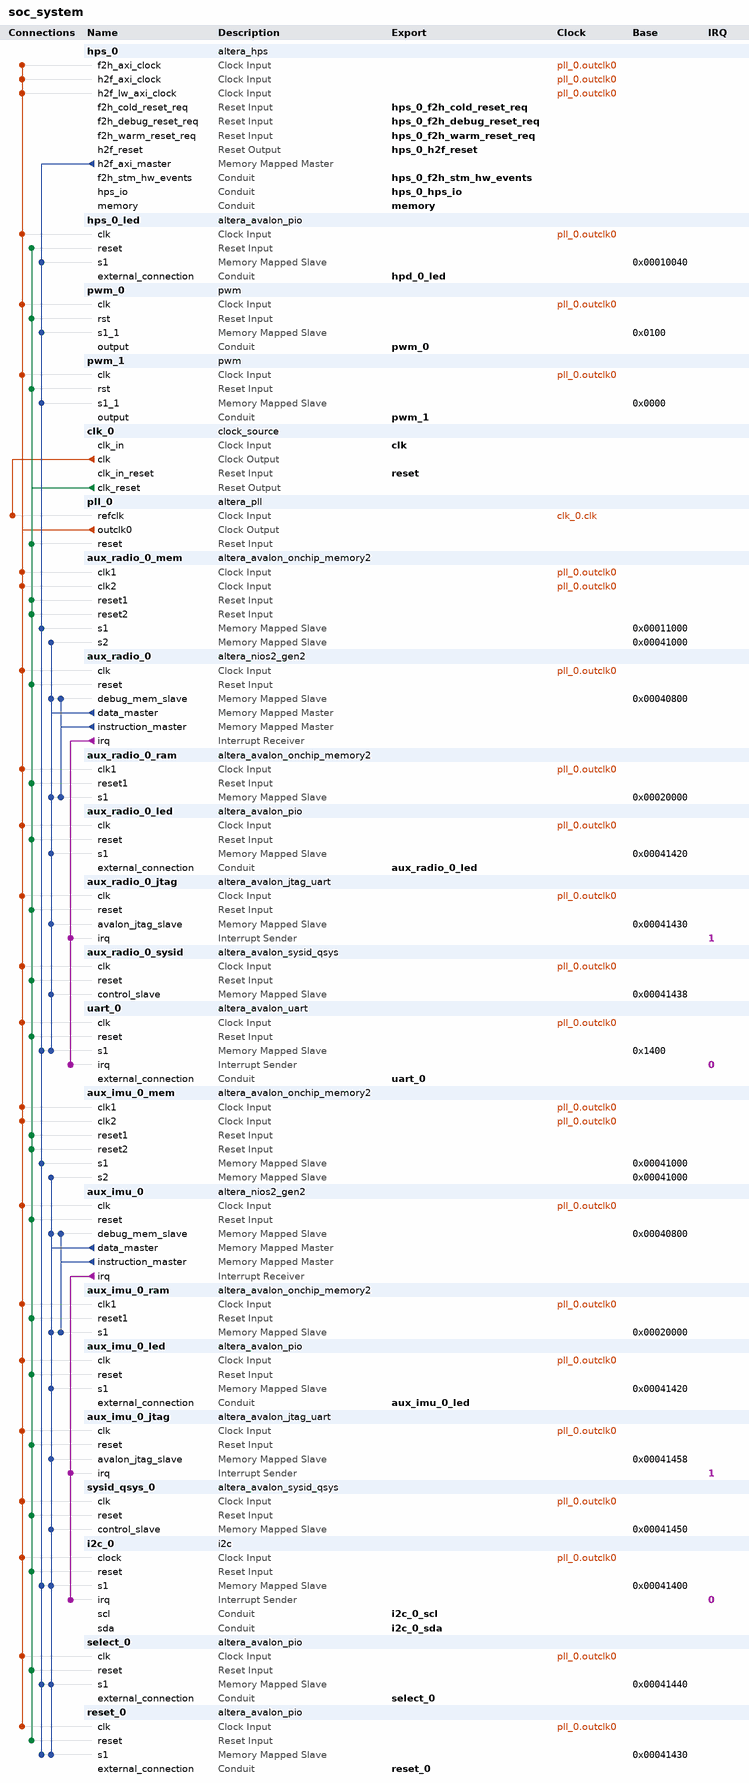
[diagram p0: system contents]
# Platform Designer (Qsys) system soc_system, Cyclone V 5CSEMA4U23C6
# Parameters at their usual value, and those the tool derives, are not listed.
package require -exact qsys 16.0
create_system soc_system
set_project_property DEVICE_FAMILY {Cyclone V}
set_project_property DEVICE 5CSEMA4U23C6

add_instance hps_0 altera_hps 16.0
set_instance_parameter_value hps_0 EMAC1_Mode RGMII
set_instance_parameter_value hps_0 EMAC1_PinMuxing {HPS I/O Set 0}
set_instance_parameter_value hps_0 F2SCLK_COLDRST_Enable true
set_instance_parameter_value hps_0 F2SCLK_DBGRST_Enable true
set_instance_parameter_value hps_0 F2SCLK_WARMRST_Enable true
set_instance_parameter_value hps_0 F2SINTERRUPT_Enable true
set_instance_parameter_value hps_0 F2S_Width 3
set_instance_parameter_value hps_0 FPGA_PERIPHERAL_OUTPUT_CLOCK_FREQ_EMAC0_GTX_CLK 100
set_instance_parameter_value hps_0 FPGA_PERIPHERAL_OUTPUT_CLOCK_FREQ_EMAC0_MD_CLK 100.0
set_instance_parameter_value hps_0 FPGA_PERIPHERAL_OUTPUT_CLOCK_FREQ_EMAC1_GTX_CLK 100
set_instance_parameter_value hps_0 FPGA_PERIPHERAL_OUTPUT_CLOCK_FREQ_EMAC1_MD_CLK 100.0
set_instance_parameter_value hps_0 HPS_PROTOCOL DDR3
set_instance_parameter_value hps_0 I2C0_Mode I2C
set_instance_parameter_value hps_0 I2C0_PinMuxing {HPS I/O Set 0}
set_instance_parameter_value hps_0 I2C1_Mode I2C
set_instance_parameter_value hps_0 I2C1_PinMuxing {HPS I/O Set 0}
set_instance_parameter_value hps_0 LWH2F_Enable true
set_instance_parameter_value hps_0 MEM_BANKADDR_WIDTH 3
set_instance_parameter_value hps_0 MEM_CLK_FREQ 400.0
set_instance_parameter_value hps_0 MEM_COL_ADDR_WIDTH 10
set_instance_parameter_value hps_0 MEM_DQ_WIDTH 32
set_instance_parameter_value hps_0 MEM_DRV_STR RZQ/6
set_instance_parameter_value hps_0 MEM_ROW_ADDR_WIDTH 15
set_instance_parameter_value hps_0 MEM_RTT_NOM RZQ/6
set_instance_parameter_value hps_0 MEM_RTT_WR {Dynamic ODT off}
set_instance_parameter_value hps_0 MEM_TCL 7
set_instance_parameter_value hps_0 MEM_TFAW_NS 37.5
set_instance_parameter_value hps_0 MEM_TRAS_NS 35.0
set_instance_parameter_value hps_0 MEM_TRCD_NS 13.75
set_instance_parameter_value hps_0 MEM_TRFC_NS 300.0
set_instance_parameter_value hps_0 MEM_TRP_NS 13.75
set_instance_parameter_value hps_0 MEM_VENDOR Other
set_instance_parameter_value hps_0 MEM_WTCL 7
set_instance_parameter_value hps_0 QSPI_Mode N/A
set_instance_parameter_value hps_0 QSPI_PinMuxing Unused
set_instance_parameter_value hps_0 REF_CLK_FREQ 25.0
set_instance_parameter_value hps_0 S2FCLK_USER2CLK 5
set_instance_parameter_value hps_0 S2F_Width 2
set_instance_parameter_value hps_0 SDIO_Mode {4-bit Data}
set_instance_parameter_value hps_0 SDIO_PinMuxing {HPS I/O Set 0}
set_instance_parameter_value hps_0 SPIM1_Mode {Single Slave Select}
set_instance_parameter_value hps_0 SPIM1_PinMuxing {HPS I/O Set 0}
set_instance_parameter_value hps_0 STM_Enable true
set_instance_parameter_value hps_0 TIMING_BOARD_AC_SKEW 0.02
set_instance_parameter_value hps_0 TIMING_BOARD_AC_TO_CK_SKEW 0.0
set_instance_parameter_value hps_0 TIMING_BOARD_DQ_TO_DQS_SKEW 0.0
set_instance_parameter_value hps_0 TIMING_BOARD_MAX_CK_DELAY 0.6
set_instance_parameter_value hps_0 TIMING_BOARD_MAX_DQS_DELAY 0.6
set_instance_parameter_value hps_0 TIMING_BOARD_SKEW_BETWEEN_DQS 0.02
set_instance_parameter_value hps_0 TIMING_BOARD_SKEW_CKDQS_DIMM_MAX 0.01
set_instance_parameter_value hps_0 TIMING_BOARD_SKEW_CKDQS_DIMM_MIN -0.01
set_instance_parameter_value hps_0 TIMING_BOARD_SKEW_WITHIN_DQS 0.02
set_instance_parameter_value hps_0 TIMING_TDH 125
set_instance_parameter_value hps_0 TIMING_TDQSCK 400
set_instance_parameter_value hps_0 TIMING_TDQSQ 120
set_instance_parameter_value hps_0 TIMING_TDS 50
set_instance_parameter_value hps_0 TIMING_TIH 250
set_instance_parameter_value hps_0 TIMING_TIS 175
set_instance_parameter_value hps_0 TIMING_TQSH 0.38
set_instance_parameter_value hps_0 UART0_Mode {No Flow Control}
set_instance_parameter_value hps_0 UART0_PinMuxing {HPS I/O Set 0}
set_instance_parameter_value hps_0 USB1_Mode SDR
set_instance_parameter_value hps_0 USB1_PinMuxing {HPS I/O Set 0}
set_instance_parameter_value hps_0 desired_cfg_clk_mhz 100.0
set_instance_parameter_value hps_0 desired_qspi_clk_mhz 370.0

add_instance hps_0_led altera_avalon_pio 16.0
set_instance_parameter_value hps_0_led direction Output
set_instance_parameter_value hps_0_led resetValue 1
set_instance_parameter_value hps_0_led width 1

add_instance pwm_0 pwm 1.0
set_instance_parameter_value pwm_0 BLANK_COUNTER_LENGTH 6
set_instance_parameter_value pwm_0 PRESCALER_COUNTER_LENGTH 8
set_instance_parameter_value pwm_0 PWM_COUNTER_LENGTH 14
set_instance_parameter_value pwm_0 QUANTITY 5

add_instance pwm_1 pwm 1.0
set_instance_parameter_value pwm_1 BLANK_COUNTER_LENGTH 6
set_instance_parameter_value pwm_1 PRESCALER_COUNTER_LENGTH 8
set_instance_parameter_value pwm_1 PWM_COUNTER_LENGTH 14
set_instance_parameter_value pwm_1 QUANTITY 5

add_instance clk_0 clock_source 16.0
set_instance_parameter_value clk_0 clockFrequency 50000000

add_instance pll_0 altera_pll 16.0
set_instance_parameter_value pll_0 gui_device_speed_grade 1
set_instance_parameter_value pll_0 gui_number_of_clocks 1
set_instance_parameter_value pll_0 gui_operation_mode direct
set_instance_parameter_value pll_0 gui_output_clock_frequency0 75.0
set_instance_parameter_value pll_0 gui_pll_mode {Integer-N PLL}
set_instance_parameter_value pll_0 gui_reference_clock_frequency 50.0
set_instance_parameter_value pll_0 gui_use_locked true

add_instance aux_radio_0_mem altera_avalon_onchip_memory2 16.0
set_instance_parameter_value aux_radio_0_mem blockType M10K
set_instance_parameter_value aux_radio_0_mem dataWidth 32
set_instance_parameter_value aux_radio_0_mem dualPort true
set_instance_parameter_value aux_radio_0_mem initMemContent true
set_instance_parameter_value aux_radio_0_mem initializationFileName C:/PROJECTS/GHRD_quad_v4_0/GHRD/software/aux_radio_0/mem_init/init_aux_radio_0_mem.hex
set_instance_parameter_value aux_radio_0_mem memorySize 1024
set_instance_parameter_value aux_radio_0_mem readDuringWriteMode OLD_DATA
set_instance_parameter_value aux_radio_0_mem useNonDefaultInitFile true

add_instance aux_radio_0 altera_nios2_gen2 16.0
set_instance_parameter_value aux_radio_0 dcache_size 2048
set_instance_parameter_value aux_radio_0 exceptionSlave aux_radio_0_ram.s1
set_instance_parameter_value aux_radio_0 icache_size 4096
set_instance_parameter_value aux_radio_0 impl Tiny
set_instance_parameter_value aux_radio_0 resetSlave aux_radio_0_ram.s1

add_instance aux_radio_0_ram altera_avalon_onchip_memory2 16.0
set_instance_parameter_value aux_radio_0_ram dataWidth 32
set_instance_parameter_value aux_radio_0_ram dualPort false
set_instance_parameter_value aux_radio_0_ram initMemContent true
set_instance_parameter_value aux_radio_0_ram initializationFileName C:/PROJECTS/GHRD_quad_v4_0/GHRD/software/aux_radio_0/mem_init/init_aux_radio_0_ram.hex
set_instance_parameter_value aux_radio_0_ram memorySize 76800
set_instance_parameter_value aux_radio_0_ram useNonDefaultInitFile true

add_instance aux_radio_0_led altera_avalon_pio 16.0
set_instance_parameter_value aux_radio_0_led direction Output
set_instance_parameter_value aux_radio_0_led resetValue 5
set_instance_parameter_value aux_radio_0_led width 3

add_instance aux_radio_0_jtag altera_avalon_jtag_uart 16.0
set_instance_parameter_value aux_radio_0_jtag simInteractiveOptions NO_INTERACTIVE_WINDOWS

add_instance aux_radio_0_sysid altera_avalon_sysid_qsys 16.0
set_instance_parameter_value aux_radio_0_sysid id 0

add_instance uart_0 altera_avalon_uart 16.0
set_instance_parameter_value uart_0 baud 115200
set_instance_parameter_value uart_0 dataBits 8
set_instance_parameter_value uart_0 fixedBaud false
set_instance_parameter_value uart_0 parity NONE
set_instance_parameter_value uart_0 stopBits 1

add_instance aux_imu_0_mem altera_avalon_onchip_memory2 16.0
set_instance_parameter_value aux_imu_0_mem blockType M10K
set_instance_parameter_value aux_imu_0_mem dataWidth 32
set_instance_parameter_value aux_imu_0_mem dualPort true
set_instance_parameter_value aux_imu_0_mem initMemContent true
set_instance_parameter_value aux_imu_0_mem initializationFileName C:/PROJECTS/GHRD_quad_v4_0/GHRD/software/aux_imu_0/mem_init/init_aux_imu_0_mem.hex
set_instance_parameter_value aux_imu_0_mem memorySize 1024
set_instance_parameter_value aux_imu_0_mem readDuringWriteMode OLD_DATA
set_instance_parameter_value aux_imu_0_mem useNonDefaultInitFile true

add_instance aux_imu_0 altera_nios2_gen2 16.0
set_instance_parameter_value aux_imu_0 dcache_size 2048
set_instance_parameter_value aux_imu_0 exceptionSlave aux_imu_0_ram.s1
set_instance_parameter_value aux_imu_0 icache_size 4096
set_instance_parameter_value aux_imu_0 impl Tiny
set_instance_parameter_value aux_imu_0 resetSlave aux_imu_0_ram.s1

add_instance aux_imu_0_ram altera_avalon_onchip_memory2 16.0
set_instance_parameter_value aux_imu_0_ram dataWidth 32
set_instance_parameter_value aux_imu_0_ram dualPort false
set_instance_parameter_value aux_imu_0_ram initMemContent true
set_instance_parameter_value aux_imu_0_ram initializationFileName C:/PROJECTS/GHRD_quad_v4_0/GHRD/software/aux_imu_0/mem_init/init_aux_imu_0_ram.hex
set_instance_parameter_value aux_imu_0_ram memorySize 76800
set_instance_parameter_value aux_imu_0_ram useNonDefaultInitFile true

add_instance aux_imu_0_led altera_avalon_pio 16.0
set_instance_parameter_value aux_imu_0_led direction Output
set_instance_parameter_value aux_imu_0_led resetValue 5
set_instance_parameter_value aux_imu_0_led width 4

add_instance aux_imu_0_jtag altera_avalon_jtag_uart 16.0
set_instance_parameter_value aux_imu_0_jtag simInteractiveOptions NO_INTERACTIVE_WINDOWS

add_instance sysid_qsys_0 altera_avalon_sysid_qsys 16.0
set_instance_parameter_value sysid_qsys_0 id 1

add_instance i2c_0 i2c 1.0

add_instance select_0 altera_avalon_pio 16.0
set_instance_parameter_value select_0 direction Output
set_instance_parameter_value select_0 width 4

add_instance reset_0 altera_avalon_pio 16.0
set_instance_parameter_value reset_0 direction Output
set_instance_parameter_value reset_0 resetValue 15
set_instance_parameter_value reset_0 width 4

# connections
add_connection clk_0.clk pll_0.refclk clock
add_connection pll_0.outclk0 aux_imu_0.clk clock
add_connection pll_0.outclk0 aux_imu_0_jtag.clk clock
add_connection pll_0.outclk0 aux_imu_0_led.clk clock
add_connection pll_0.outclk0 aux_imu_0_mem.clk1 clock
add_connection pll_0.outclk0 aux_imu_0_mem.clk2 clock
add_connection pll_0.outclk0 aux_imu_0_ram.clk1 clock
add_connection pll_0.outclk0 aux_radio_0.clk clock
add_connection pll_0.outclk0 aux_radio_0_jtag.clk clock
add_connection pll_0.outclk0 aux_radio_0_led.clk clock
add_connection pll_0.outclk0 aux_radio_0_mem.clk1 clock
add_connection pll_0.outclk0 aux_radio_0_mem.clk2 clock
add_connection pll_0.outclk0 aux_radio_0_ram.clk1 clock
add_connection pll_0.outclk0 aux_radio_0_sysid.clk clock
add_connection pll_0.outclk0 hps_0.f2h_axi_clock clock
add_connection pll_0.outclk0 hps_0.h2f_axi_clock clock
add_connection pll_0.outclk0 hps_0.h2f_lw_axi_clock clock
add_connection pll_0.outclk0 hps_0_led.clk clock
add_connection pll_0.outclk0 i2c_0.clock clock
add_connection pll_0.outclk0 pwm_0.clk clock
add_connection pll_0.outclk0 pwm_1.clk clock
add_connection pll_0.outclk0 reset_0.clk clock
add_connection pll_0.outclk0 select_0.clk clock
add_connection pll_0.outclk0 sysid_qsys_0.clk clock
add_connection pll_0.outclk0 uart_0.clk clock
add_connection clk_0.clk_reset aux_imu_0.reset reset
add_connection clk_0.clk_reset aux_imu_0_jtag.reset reset
add_connection clk_0.clk_reset aux_imu_0_led.reset reset
add_connection clk_0.clk_reset aux_imu_0_mem.reset1 reset
add_connection clk_0.clk_reset aux_imu_0_mem.reset2 reset
add_connection clk_0.clk_reset aux_imu_0_ram.reset1 reset
add_connection clk_0.clk_reset aux_radio_0.reset reset
add_connection clk_0.clk_reset aux_radio_0_jtag.reset reset
add_connection clk_0.clk_reset aux_radio_0_led.reset reset
add_connection clk_0.clk_reset aux_radio_0_mem.reset1 reset
add_connection clk_0.clk_reset aux_radio_0_mem.reset2 reset
add_connection clk_0.clk_reset aux_radio_0_ram.reset1 reset
add_connection clk_0.clk_reset aux_radio_0_sysid.reset reset
add_connection clk_0.clk_reset hps_0_led.reset reset
add_connection clk_0.clk_reset i2c_0.reset reset
add_connection clk_0.clk_reset pll_0.reset reset
add_connection clk_0.clk_reset pwm_0.rst reset
add_connection clk_0.clk_reset pwm_1.rst reset
add_connection clk_0.clk_reset reset_0.reset reset
add_connection clk_0.clk_reset select_0.reset reset
add_connection clk_0.clk_reset sysid_qsys_0.reset reset
add_connection clk_0.clk_reset uart_0.reset reset
add_connection aux_imu_0.data_master aux_imu_0.debug_mem_slave avalon
set_connection_parameter_value aux_imu_0.data_master/aux_imu_0.debug_mem_slave baseAddress 0x00040800
add_connection aux_imu_0.data_master aux_imu_0_jtag.avalon_jtag_slave avalon
set_connection_parameter_value aux_imu_0.data_master/aux_imu_0_jtag.avalon_jtag_slave baseAddress 0x00041458
add_connection aux_imu_0.data_master aux_imu_0_led.s1 avalon
set_connection_parameter_value aux_imu_0.data_master/aux_imu_0_led.s1 baseAddress 0x00041420
add_connection aux_imu_0.data_master aux_imu_0_mem.s2 avalon
set_connection_parameter_value aux_imu_0.data_master/aux_imu_0_mem.s2 baseAddress 0x00041000
add_connection aux_imu_0.data_master aux_imu_0_ram.s1 avalon
set_connection_parameter_value aux_imu_0.data_master/aux_imu_0_ram.s1 baseAddress 0x00020000
add_connection aux_imu_0.data_master i2c_0.s1 avalon
set_connection_parameter_value aux_imu_0.data_master/i2c_0.s1 baseAddress 0x00041400
add_connection aux_imu_0.data_master reset_0.s1 avalon
set_connection_parameter_value aux_imu_0.data_master/reset_0.s1 baseAddress 0x00041430
add_connection aux_imu_0.data_master select_0.s1 avalon
set_connection_parameter_value aux_imu_0.data_master/select_0.s1 baseAddress 0x00041440
add_connection aux_imu_0.data_master sysid_qsys_0.control_slave avalon
set_connection_parameter_value aux_imu_0.data_master/sysid_qsys_0.control_slave baseAddress 0x00041450
add_connection aux_imu_0.instruction_master aux_imu_0.debug_mem_slave avalon
set_connection_parameter_value aux_imu_0.instruction_master/aux_imu_0.debug_mem_slave baseAddress 0x00040800
add_connection aux_imu_0.instruction_master aux_imu_0_ram.s1 avalon
set_connection_parameter_value aux_imu_0.instruction_master/aux_imu_0_ram.s1 baseAddress 0x00020000
add_connection aux_radio_0.data_master aux_radio_0.debug_mem_slave avalon
set_connection_parameter_value aux_radio_0.data_master/aux_radio_0.debug_mem_slave baseAddress 0x00040800
add_connection aux_radio_0.data_master aux_radio_0_jtag.avalon_jtag_slave avalon
set_connection_parameter_value aux_radio_0.data_master/aux_radio_0_jtag.avalon_jtag_slave baseAddress 0x00041430
add_connection aux_radio_0.data_master aux_radio_0_led.s1 avalon
set_connection_parameter_value aux_radio_0.data_master/aux_radio_0_led.s1 baseAddress 0x00041420
add_connection aux_radio_0.data_master aux_radio_0_mem.s2 avalon
set_connection_parameter_value aux_radio_0.data_master/aux_radio_0_mem.s2 baseAddress 0x00041000
add_connection aux_radio_0.data_master aux_radio_0_ram.s1 avalon
set_connection_parameter_value aux_radio_0.data_master/aux_radio_0_ram.s1 baseAddress 0x00020000
add_connection aux_radio_0.data_master aux_radio_0_sysid.control_slave avalon
set_connection_parameter_value aux_radio_0.data_master/aux_radio_0_sysid.control_slave baseAddress 0x00041438
add_connection aux_radio_0.data_master uart_0.s1 avalon
set_connection_parameter_value aux_radio_0.data_master/uart_0.s1 baseAddress 0x1400
add_connection aux_radio_0.instruction_master aux_radio_0.debug_mem_slave avalon
set_connection_parameter_value aux_radio_0.instruction_master/aux_radio_0.debug_mem_slave baseAddress 0x00040800
add_connection aux_radio_0.instruction_master aux_radio_0_ram.s1 avalon
set_connection_parameter_value aux_radio_0.instruction_master/aux_radio_0_ram.s1 baseAddress 0x00020000
add_connection hps_0.h2f_axi_master aux_imu_0_mem.s1 avalon
set_connection_parameter_value hps_0.h2f_axi_master/aux_imu_0_mem.s1 baseAddress 0x00041000
add_connection hps_0.h2f_axi_master aux_radio_0_mem.s1 avalon
set_connection_parameter_value hps_0.h2f_axi_master/aux_radio_0_mem.s1 baseAddress 0x00011000
add_connection hps_0.h2f_axi_master hps_0_led.s1 avalon
set_connection_parameter_value hps_0.h2f_axi_master/hps_0_led.s1 baseAddress 0x00010040
add_connection hps_0.h2f_axi_master i2c_0.s1 avalon
set_connection_parameter_value hps_0.h2f_axi_master/i2c_0.s1 baseAddress 0x00041400
add_connection hps_0.h2f_axi_master pwm_0.s1_1 avalon
set_connection_parameter_value hps_0.h2f_axi_master/pwm_0.s1_1 baseAddress 0x0100
add_connection hps_0.h2f_axi_master pwm_1.s1_1 avalon
set_connection_parameter_value hps_0.h2f_axi_master/pwm_1.s1_1 baseAddress 0x0000
add_connection hps_0.h2f_axi_master reset_0.s1 avalon
set_connection_parameter_value hps_0.h2f_axi_master/reset_0.s1 baseAddress 0x00041430
add_connection hps_0.h2f_axi_master select_0.s1 avalon
set_connection_parameter_value hps_0.h2f_axi_master/select_0.s1 baseAddress 0x00041440
add_connection hps_0.h2f_axi_master uart_0.s1 avalon
set_connection_parameter_value hps_0.h2f_axi_master/uart_0.s1 baseAddress 0x1400
add_connection aux_imu_0.irq aux_imu_0_jtag.irq interrupt
set_connection_parameter_value aux_imu_0.irq/aux_imu_0_jtag.irq irqNumber 1
add_connection aux_imu_0.irq i2c_0.irq interrupt
set_connection_parameter_value aux_imu_0.irq/i2c_0.irq irqNumber 0
add_connection aux_radio_0.irq aux_radio_0_jtag.irq interrupt
set_connection_parameter_value aux_radio_0.irq/aux_radio_0_jtag.irq irqNumber 1
add_connection aux_radio_0.irq uart_0.irq interrupt
set_connection_parameter_value aux_radio_0.irq/uart_0.irq irqNumber 0

# exported interfaces
add_interface aux_imu_0_led conduit end
set_interface_property aux_imu_0_led EXPORT_OF aux_imu_0_led.external_connection
add_interface aux_radio_0_led conduit end
set_interface_property aux_radio_0_led EXPORT_OF aux_radio_0_led.external_connection
add_interface clk clock sink
set_interface_property clk EXPORT_OF clk_0.clk_in
add_interface hpd_0_led conduit end
set_interface_property hpd_0_led EXPORT_OF hps_0_led.external_connection
add_interface hps_0_f2h_cold_reset_req reset sink
set_interface_property hps_0_f2h_cold_reset_req EXPORT_OF hps_0.f2h_cold_reset_req
add_interface hps_0_f2h_debug_reset_req reset sink
set_interface_property hps_0_f2h_debug_reset_req EXPORT_OF hps_0.f2h_debug_reset_req
add_interface hps_0_f2h_stm_hw_events conduit end
set_interface_property hps_0_f2h_stm_hw_events EXPORT_OF hps_0.f2h_stm_hw_events
add_interface hps_0_f2h_warm_reset_req reset sink
set_interface_property hps_0_f2h_warm_reset_req EXPORT_OF hps_0.f2h_warm_reset_req
add_interface hps_0_h2f_reset reset source
set_interface_property hps_0_h2f_reset EXPORT_OF hps_0.h2f_reset
add_interface hps_0_hps_io conduit end
set_interface_property hps_0_hps_io EXPORT_OF hps_0.hps_io
add_interface i2c_0_scl conduit end
set_interface_property i2c_0_scl EXPORT_OF i2c_0.scl
add_interface i2c_0_sda conduit end
set_interface_property i2c_0_sda EXPORT_OF i2c_0.sda
add_interface memory conduit end
set_interface_property memory EXPORT_OF hps_0.memory
add_interface pwm_0 conduit end
set_interface_property pwm_0 EXPORT_OF pwm_0.output
add_interface pwm_1 conduit end
set_interface_property pwm_1 EXPORT_OF pwm_1.output
add_interface reset reset sink
set_interface_property reset EXPORT_OF clk_0.clk_in_reset
add_interface reset_0 conduit end
set_interface_property reset_0 EXPORT_OF reset_0.external_connection
add_interface select_0 conduit end
set_interface_property select_0 EXPORT_OF select_0.external_connection
add_interface uart_0 conduit end
set_interface_property uart_0 EXPORT_OF uart_0.external_connection

set_interconnect_requirement {$system} qsys_mm.clockCrossingAdapter HANDSHAKE
set_interconnect_requirement {$system} qsys_mm.maxAdditionalLatency 1

save_system soc_system.qsys
